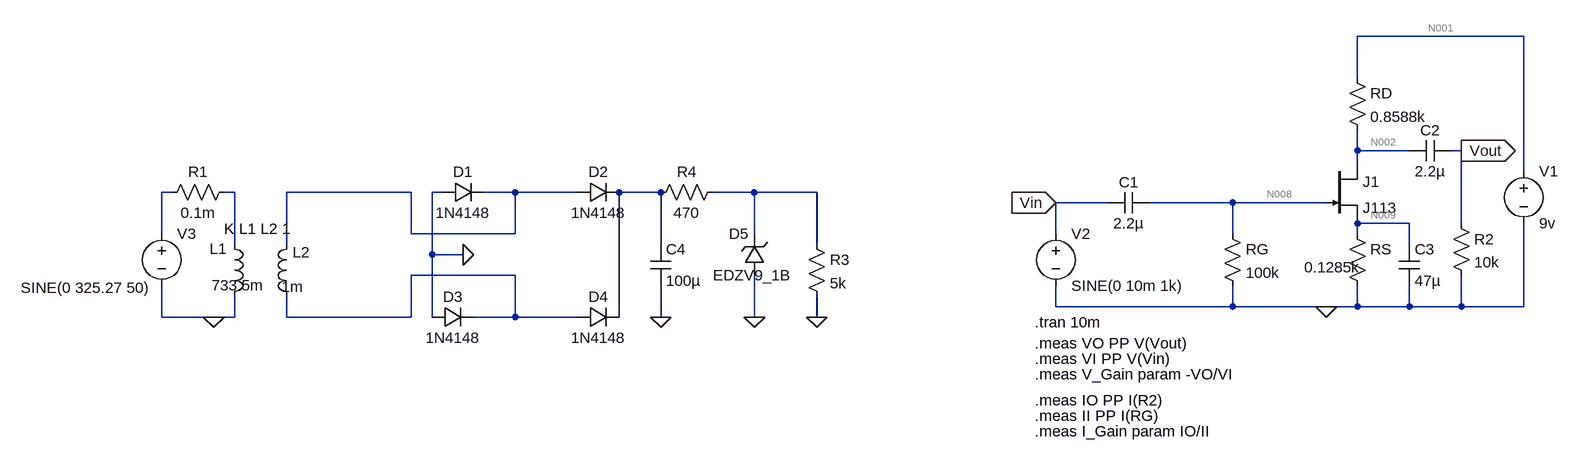
[diagram p0: schematic PreAmp.asc]
PreAmp.asc, the LTspice schematic file:
Version 4.1
SHEET 1 880 680
WIRE 528 -416 272 -416
WIRE 272 -352 272 -416
WIRE 272 -240 272 -272
WIRE 352 -240 272 -240
WIRE 432 -240 416 -240
WIRE 272 -224 272 -240
WIRE 528 -208 528 -416
WIRE -1552 -176 -1568 -176
WIRE -1456 -176 -1472 -176
WIRE -1184 -176 -1376 -176
WIRE -1136 -176 -1152 -176
WIRE -1024 -176 -1072 -176
WIRE -928 -176 -1024 -176
WIRE -800 -176 -864 -176
WIRE -656 -176 -720 -176
WIRE -560 -176 -656 -176
WIRE -112 -160 -192 -160
WIRE 80 -160 -48 -160
WIRE 224 -160 80 -160
WIRE 352 -128 272 -128
WIRE 432 -128 432 -240
WIRE -1568 -112 -1568 -176
WIRE -1184 -112 -1184 -176
WIRE -1024 -112 -1024 -176
WIRE -1024 -112 -1184 -112
WIRE -656 -112 -656 -176
WIRE -192 -112 -192 -160
WIRE 80 -112 80 -160
WIRE 272 -112 272 -128
WIRE -1456 -96 -1456 -176
WIRE -1376 -96 -1376 -176
WIRE -800 -96 -800 -176
WIRE -560 -96 -560 -176
WIRE 352 -96 352 -128
WIRE -1152 -80 -1152 -176
WIRE -1104 -80 -1152 -80
WIRE -1024 -48 -1184 -48
WIRE -192 0 -192 -32
WIRE 80 0 80 -32
WIRE 80 0 -192 0
WIRE 224 0 80 0
WIRE 272 0 272 -32
WIRE 272 0 224 0
WIRE 352 0 352 -32
WIRE 352 0 272 0
WIRE 432 0 432 -48
WIRE 432 0 352 0
WIRE 528 0 528 -128
WIRE 528 0 432 0
WIRE -1568 16 -1568 -32
WIRE -1488 16 -1568 16
WIRE -1456 16 -1456 -16
WIRE -1456 16 -1488 16
WIRE -1376 16 -1376 -16
WIRE -1184 16 -1184 -48
WIRE -1184 16 -1376 16
WIRE -1152 16 -1152 -80
WIRE -1024 16 -1024 -48
WIRE -1024 16 -1088 16
WIRE -928 16 -1024 16
WIRE -864 16 -864 -176
WIRE -800 16 -800 -32
WIRE -656 16 -656 -48
WIRE -560 16 -560 -16
FLAG 224 0 0
FLAG -192 -160 Vin
IOPIN -192 -160 In
FLAG 432 -240 Vout
IOPIN 432 -240 Out
FLAG -1488 16 0
FLAG -1104 -80 0
FLAG -560 16 0
FLAG -800 16 0
FLAG -656 16 0
SYMBOL njf 224 -224 R0
SYMATTR InstName J1
SYMATTR Value J113
SYMBOL res 256 -368 R0
SYMATTR InstName RD
SYMATTR Value 0.8588k
SYMBOL voltage 528 -224 R0
WINDOW 123 0 0 Left 0
WINDOW 39 0 0 Left 0
SYMATTR InstName V1
SYMATTR Value 9v
SYMBOL voltage -192 -128 R0
WINDOW 123 0 0 Left 0
WINDOW 39 0 0 Left 0
SYMATTR InstName V2
SYMATTR Value SINE(0 10m 1k)
SYMBOL cap -48 -176 R90
WINDOW 0 0 32 VBottom 2
WINDOW 3 32 32 VTop 2
SYMATTR InstName C1
SYMATTR Value 2.2µ
SYMBOL cap 416 -256 R90
WINDOW 0 0 32 VBottom 2
WINDOW 3 32 32 VTop 2
SYMATTR InstName C2
SYMATTR Value 2.2µ
SYMBOL res 416 -144 R0
SYMATTR InstName R2
SYMATTR Value 10k
SYMBOL res 256 -128 R0
WINDOW 3 -66 67 Left 2
SYMATTR Value 0.1285k
SYMATTR InstName RS
SYMBOL res 64 -128 R0
SYMATTR InstName RG
SYMATTR Value 100k
SYMBOL cap 336 -96 R0
SYMATTR InstName C3
SYMATTR Value 47µ
SYMBOL ind -1472 -112 R0
WINDOW 0 -22 23 Left 2
WINDOW 3 -19 79 Left 2
SYMATTR InstName L1
SYMATTR Value 733.5m
SYMBOL ind -1360 0 R180
WINDOW 0 -20 84 Left 2
WINDOW 3 -10 31 Left 2
SYMATTR InstName L2
SYMATTR Value 1m
SYMBOL voltage -1568 -128 R0
WINDOW 3 -217 99 Left 2
WINDOW 123 0 0 Left 0
WINDOW 39 0 0 Left 0
SYMATTR Value SINE(0 325.27 50)
SYMATTR InstName V3
SYMBOL res -1456 -192 R90
WINDOW 0 0 56 VBottom 2
WINDOW 3 32 56 VTop 2
SYMATTR InstName R1
SYMATTR Value 0.1m
SYMBOL diode -1136 -160 R270
WINDOW 0 32 32 VTop 2
WINDOW 3 0 32 VBottom 2
SYMATTR InstName D1
SYMATTR Value 1N4148
SYMBOL diode -928 -160 R270
WINDOW 0 32 32 VTop 2
WINDOW 3 0 32 VBottom 2
SYMATTR InstName D2
SYMATTR Value 1N4148
SYMBOL diode -1152 32 R270
WINDOW 0 32 32 VTop 2
WINDOW 3 0 32 VBottom 2
SYMATTR InstName D3
SYMATTR Value 1N4148
SYMBOL diode -928 32 R270
WINDOW 0 32 32 VTop 2
WINDOW 3 0 32 VBottom 2
SYMATTR InstName D4
SYMATTR Value 1N4148
SYMBOL res -576 -112 R0
SYMATTR InstName R3
SYMATTR Value 5k
SYMBOL cap -816 -96 R0
SYMATTR InstName C4
SYMATTR Value 100µ
SYMBOL res -704 -192 R90
WINDOW 0 0 56 VBottom 2
WINDOW 3 32 56 VTop 2
SYMATTR InstName R4
SYMATTR Value 470
SYMBOL zener -640 -48 R180
WINDOW 0 24 64 Left 2
WINDOW 3 -40 0 Left 2
SYMATTR InstName D5
SYMATTR Value EDZV9_1B
TEXT -224 24 Left 2 !.tran 10m
TEXT -224 56 Left 2 !.meas VO PP V(Vout)
TEXT -224 80 Left 2 !.meas VI PP V(Vin)
TEXT -224 104 Left 2 !.meas V_Gain param -VO/VI
TEXT -224 144 Left 2 !.meas IO PP I(R2)
TEXT -224 168 Left 2 !.meas II PP I(RG)
TEXT -224 192 Left 2 !.meas I_Gain param IO/II
TEXT -1472 -120 Left 2 !K L1 L2 1

The netlist it stands for:
* PreAmp.asc
J1 N002 N008 N009 J113
RD N001 N002 0.8588k
V1 N001 0 9v
V2 Vin 0 SINE(0 10m 1k)
C1 N008 Vin 2.2µ
C2 Vout N002 2.2µ
R2 Vout 0 10k
RS N009 0 0.1285k
RG N008 0 100k
C3 N009 0 47µ
L1 N004 0 733.5m
L2 N010 N005 1m
V3 N003 0 SINE(0 325.27 50)
R1 N004 N003 0.1m
D1 0 N005 1N4148
D2 N005 N006 1N4148
D3 0 N010 1N4148
D4 N010 N006 1N4148
R3 N007 0 5k
C4 N006 0 100µ
R4 N007 N006 470
D5 0 N007 EDZV9_1B
.model D D
.lib standard.dio
.model NJF NJF
.model PJF PJF
.lib standard.jft
.tran 10m
.meas VO PP V(Vout)
.meas VI PP V(Vin)
.meas V_Gain param -VO/VI
.meas IO PP I(R2)
.meas II PP I(RG)
.meas I_Gain param IO/II
K L1 L2 1
.backanno
.end

* Results of the author's LTspice run, read from the files saved beside the schematic
* Operating Point, zero values left out:
*   V(n008) = 1.221 µV
*   V(n001) = 9 V
*   V(n002) = 4.684 V
*   V(n009) = 645.8 mV
*   I(V1) = -5.026 mA
*   Id(J1) = 5.026 mA
*   Ig(J1) = -12.21 pA
*   Is(J1) = -5.026 mA
*   I(RS) = 5.026 mA
*   I(RD) = 5.026 mA
*   I(RG) = 12.21 pA
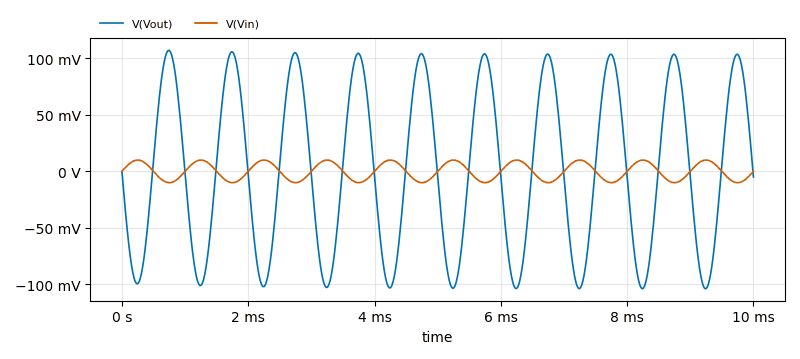
[diagram p1: Transient Analysis of PreAmp.asc, plotted from the saved traces]
* Transient Analysis, 1 run:
*   V(Vout): min -104 mV, max 107.1 mV, average 1.208 mV, rms 73.34 mV, last -4.942 mV
*   V(Vin): min -10 mV, max 10 mV, average 325.5 nV, rms 7.071 mV, last 0 V
* From the log:
*   vo: PP(V(Vout))=0.211092531681 FROM 0 TO 0.01
*   vi: PP(V(Vin))=0.0199999921024 FROM 0 TO 0.01
*   v_gain: -VO/VI=-10.5546307519
*   io: PP(I(R2))=2.11092537938e-05 FROM 0 TO 0.01
*   ii: PP(I(RG))=1.99993870353e-07 FROM 0 TO 0.01
*   i_gain: IO/II=105.549503875